# EAGLE schematic nrfice (EAGLE 9.5.1)

## Sheet 1 of 4
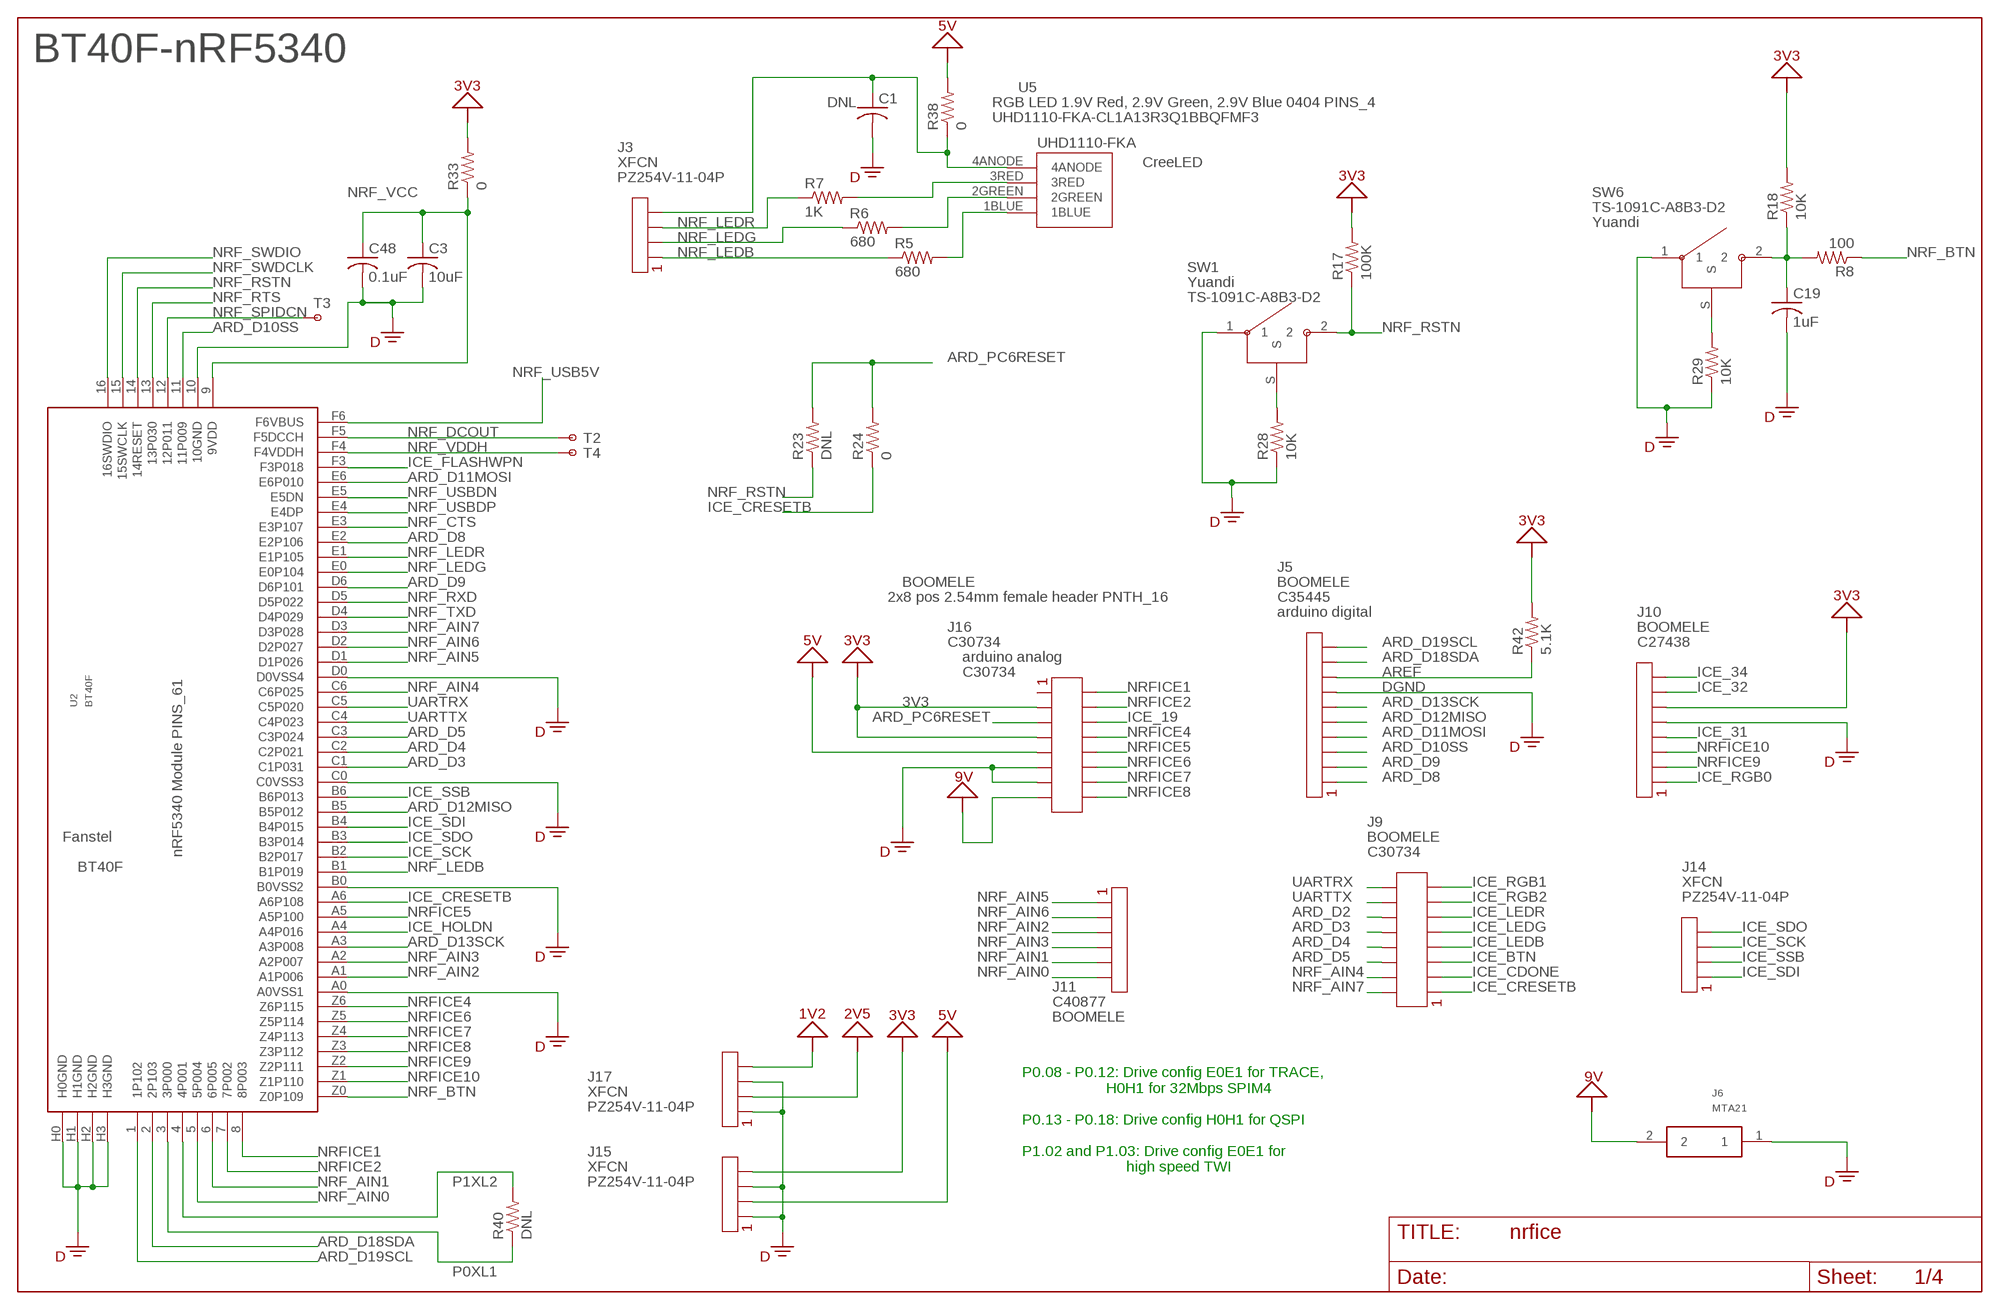
[diagram p0: schematic, sheet 1]
U$3 (FRAMES_LETTER): DESC: DNL

### Parts
C1  DNL  C-USC0402  [RCL_C0402]
C3  10uF  C-USC0805  [RCL_C0805]
C19  1uF  C-USC0402  [RCL_C0402]
C48  0.1uF  C-USC0402  [RCL_C0402]
J3  PZ254V-11-04P  [PZ254V-11-04P]
J5  C35445  [C35445]
J6  MTA21  [MTA21]
J9  C30734  [C30734]
J10  C27438  [C27438]
J11  C40877  [C40877]
J14  PZ254V-11-04P  [PZ254V-11-04P]
J15  PZ254V-11-04P  [PZ254V-11-04P]
J16  C30734  [C30734]
J17  PZ254V-11-04P  [PZ254V-11-04P]
R5  680  R-US_R0402  [RCL_R0402]
R6  680  R-US_R0402  [RCL_R0402]
R7  1K  R-US_R0402  [RCL_R0402]
R8  100  R-US_R0402  [RCL_R0402]
R17  100K  R-US_R0402  [RCL_R0402]
R18  10K  R-US_R0402  [RCL_R0402]
R23  DNL  R-US_R0402  [RCL_R0402]
R24  0  R-US_R0402  [RCL_R0402]
R28  10K  R-US_R0402  [RCL_R0402]
R29  10K  R-US_R0402  [RCL_R0402]
R33  0  R-US_R0603  [RCL_R0603]
R38  0  R-US_R0402  [RCL_R0402]
R40  DNL  R-US_R0402  [RCL_R0402]
R42  5.1K  R-US_R0402  [RCL_R0402]
SW1  TS-1091C-A8B3-D2  [TS-1091C-A8B3-D2]
SW6  TS-1091C-A8B3-D2  [TS-1091C-A8B3-D2]
T2  MTA1  [MTA1]
T3  MTA1  [MTA1]
T4  MTA1  [MTA1]
U2  BT40F  [BT40F]
U5  UHD1110-FKA  [UHD1110-FKA]

### Nets
1V2: J17.4 ; also sheet 2,3
2V5: J17.2 ; also sheet 2,3
3V3: J10.6 J15.4 J16.3 J16.7 R17.2 R18.2 R33.2 R42.2 ; also sheet 2,3,4
5V: J15.2 J16.9 R38.2 ; also sheet 2,3
9V: J6.2 J16.15 ; also sheet 2
ARD_D2: J9.12 ; also sheet 3
ARD_D3: J9.10 U2.C1(C1P031) ; also sheet 3
ARD_D4: J9.8 U2.C2(C2P021) ; also sheet 3
ARD_D5: J9.6 U2.C3(C3P024) ; also sheet 3
ARD_D8: J5.1 U2.E2(E2P106) ; also sheet 3
ARD_D9: J5.2 U2.D6(D6P101) ; also sheet 3
ARD_D10SS: J5.3 U2.11(11P009) ; also sheet 3
ARD_D11MOSI: J5.4 U2.E6(E6P010) ; also sheet 3
ARD_D12MISO: J5.5 U2.B5(B5P012) ; also sheet 3
ARD_D13SCK: J5.6 U2.A3(A3P008) ; also sheet 3
ARD_D18SDA: J5.9 U2.2(2P103) ; also sheet 3
ARD_D19SCL: J5.10 U2.1(1P102) ; also sheet 3
ARD_PC6RESET: J16.5 R23.2 R24.2
AREF: J5.8 R42.1
DGND: C1.2 C3.2 C19.2 C48.2 J5.7 J6.1 J10.5 J15.1 J15.3 J16.11 J16.13 J17.1 J17.3 R28.1 R29.1 SW1.1 SW6.1 U2.10(10GND) U2.A0(A0VSS1) U2.B0(B0VSS2) U2.C0(C0VSS3) U2.D0(D0VSS4) U2.H0(H0GND) U2.H1(H1GND) U2.H2(H2GND) U2.H3(H3GND) ; also sheet 2,3,4
ICE_19: J16.6 ; also sheet 3
ICE_31: J10.4 ; also sheet 3
ICE_32: J10.7 ; also sheet 3
ICE_34: J10.8 ; also sheet 3
ICE_BTN: J9.5 ; also sheet 3
ICE_CDONE: J9.3 ; also sheet 3
ICE_CRESETB: J9.1 R24.1 U2.A6(A6P108) ; also sheet 3
ICE_FLASHWPN: U2.F3(F3P018) ; also sheet 3
ICE_HOLDN: U2.A4(A4P016) ; also sheet 3
ICE_LEDB: J9.7 ; also sheet 3
ICE_LEDG: J9.9 ; also sheet 3
ICE_LEDR: J9.11 ; also sheet 3
ICE_RGB0: J10.1 ; also sheet 3
ICE_RGB1: J9.15 ; also sheet 3
ICE_RGB2: J9.13 ; also sheet 3
ICE_SCK: J14.3 U2.B2(B2P017) ; also sheet 3
ICE_SDI: J14.1 U2.B4(B4P015) ; also sheet 3
ICE_SDO: J14.4 U2.B3(B3P014) ; also sheet 3
ICE_SSB: J14.2 U2.B6(B6P013) ; also sheet 3
N$1: R5.2 U5.1BLUE
N$2: R6.2 U5.2GREEN
N$3: R7.2 U5.3RED
N$11: C19.1 R8.2 R18.1 SW6.2
N$13: R28.2 SW1.S
N$14: R29.2 SW6.S
N$15: C1.1 J3.4 R38.1 U5.4ANODE
NRF_AIN0: J11.6 U2.5(5P004)
NRF_AIN1: J11.5 U2.6(6P005)
NRF_AIN2: J11.3 U2.A1(A1P006)
NRF_AIN3: J11.4 U2.A2(A2P007)
NRF_AIN4: J9.4 U2.C6(C6P025)
NRF_AIN5: J11.1 U2.D1(D1P026)
NRF_AIN6: J11.2 U2.D2(D2P027)
NRF_AIN7: J9.2 U2.D3(D3P028)
NRF_BTN: R8.1 U2.Z0(Z0P109)
NRF_CTS: U2.E3(E3P107) ; also sheet 4
NRF_DCOUT: T2.1 U2.F5(F5DCCH)
NRF_LEDB: J3.1 R5.1 U2.B1(B1P019)
NRF_LEDG: J3.2 R6.1 U2.E0(E0P104)
NRF_LEDR: J3.3 R7.1 U2.E1(E1P105)
NRF_RSTN: R17.1 R23.1 SW1.2 U2.14(14RESET) ; also sheet 4
NRF_RTS: U2.13(13P030) ; also sheet 4
NRF_RXD: U2.D5(D5P022) ; also sheet 2,4
NRF_SPIDCN: T3.1 U2.12(12P011)
NRF_SWDCLK: U2.15(15SWCLK) ; also sheet 2,4
NRF_SWDIO: U2.16(16SWDIO) ; also sheet 2,4
NRF_TXD: U2.D4(D4P029) ; also sheet 2,4
NRF_USB5V: U2.F6(F6VBUS) ; also sheet 2
NRF_USBDN: U2.E5(E5DN) ; also sheet 2
NRF_USBDP: U2.E4(E4DP) ; also sheet 2
NRF_VCC: C3.1 C48.1 R33.1 U2.9(9VDD)
NRF_VDDH: T4.1 U2.F4(F4VDDH)
NRFICE1: J16.2 U2.8(8P003) ; also sheet 3
NRFICE2: J16.4 U2.7(7P002) ; also sheet 3
NRFICE4: J16.8 U2.Z6(Z6P115) ; also sheet 3
NRFICE5: J16.10 U2.A5(A5P100) ; also sheet 3
NRFICE6: J16.12 U2.Z5(Z5P114) ; also sheet 3
NRFICE7: J16.14 U2.Z4(Z4P113) ; also sheet 3
NRFICE8: J16.16 U2.Z3(Z3P112) ; also sheet 3
NRFICE9: J10.2 U2.Z2(Z2P111) ; also sheet 3
NRFICE10: J10.3 U2.Z1(Z1P110) ; also sheet 3
P0XL1: R40.1 U2.3(3P000)
P1XL2: R40.2 U2.4(4P001)
UARTRX: J9.16 U2.C5(C5P020) ; also sheet 3
UARTTX: J9.14 U2.C4(C4P023) ; also sheet 3
Unconnected: J16.1

### Notes on the sheet
- BT40F-nRF5340
- arduino digital
- arduino analog
- P0.08 - P0.12: Drive config E0E1 for TRACE, 
                       H0H1 for 32Mbps SPIM4
  
  P0.13 - P0.18: Drive config H0H1 for QSPI
  
  P1.02 and P1.03: Drive config E0E1 for 
                            high speed TWI

## Sheet 2 of 4
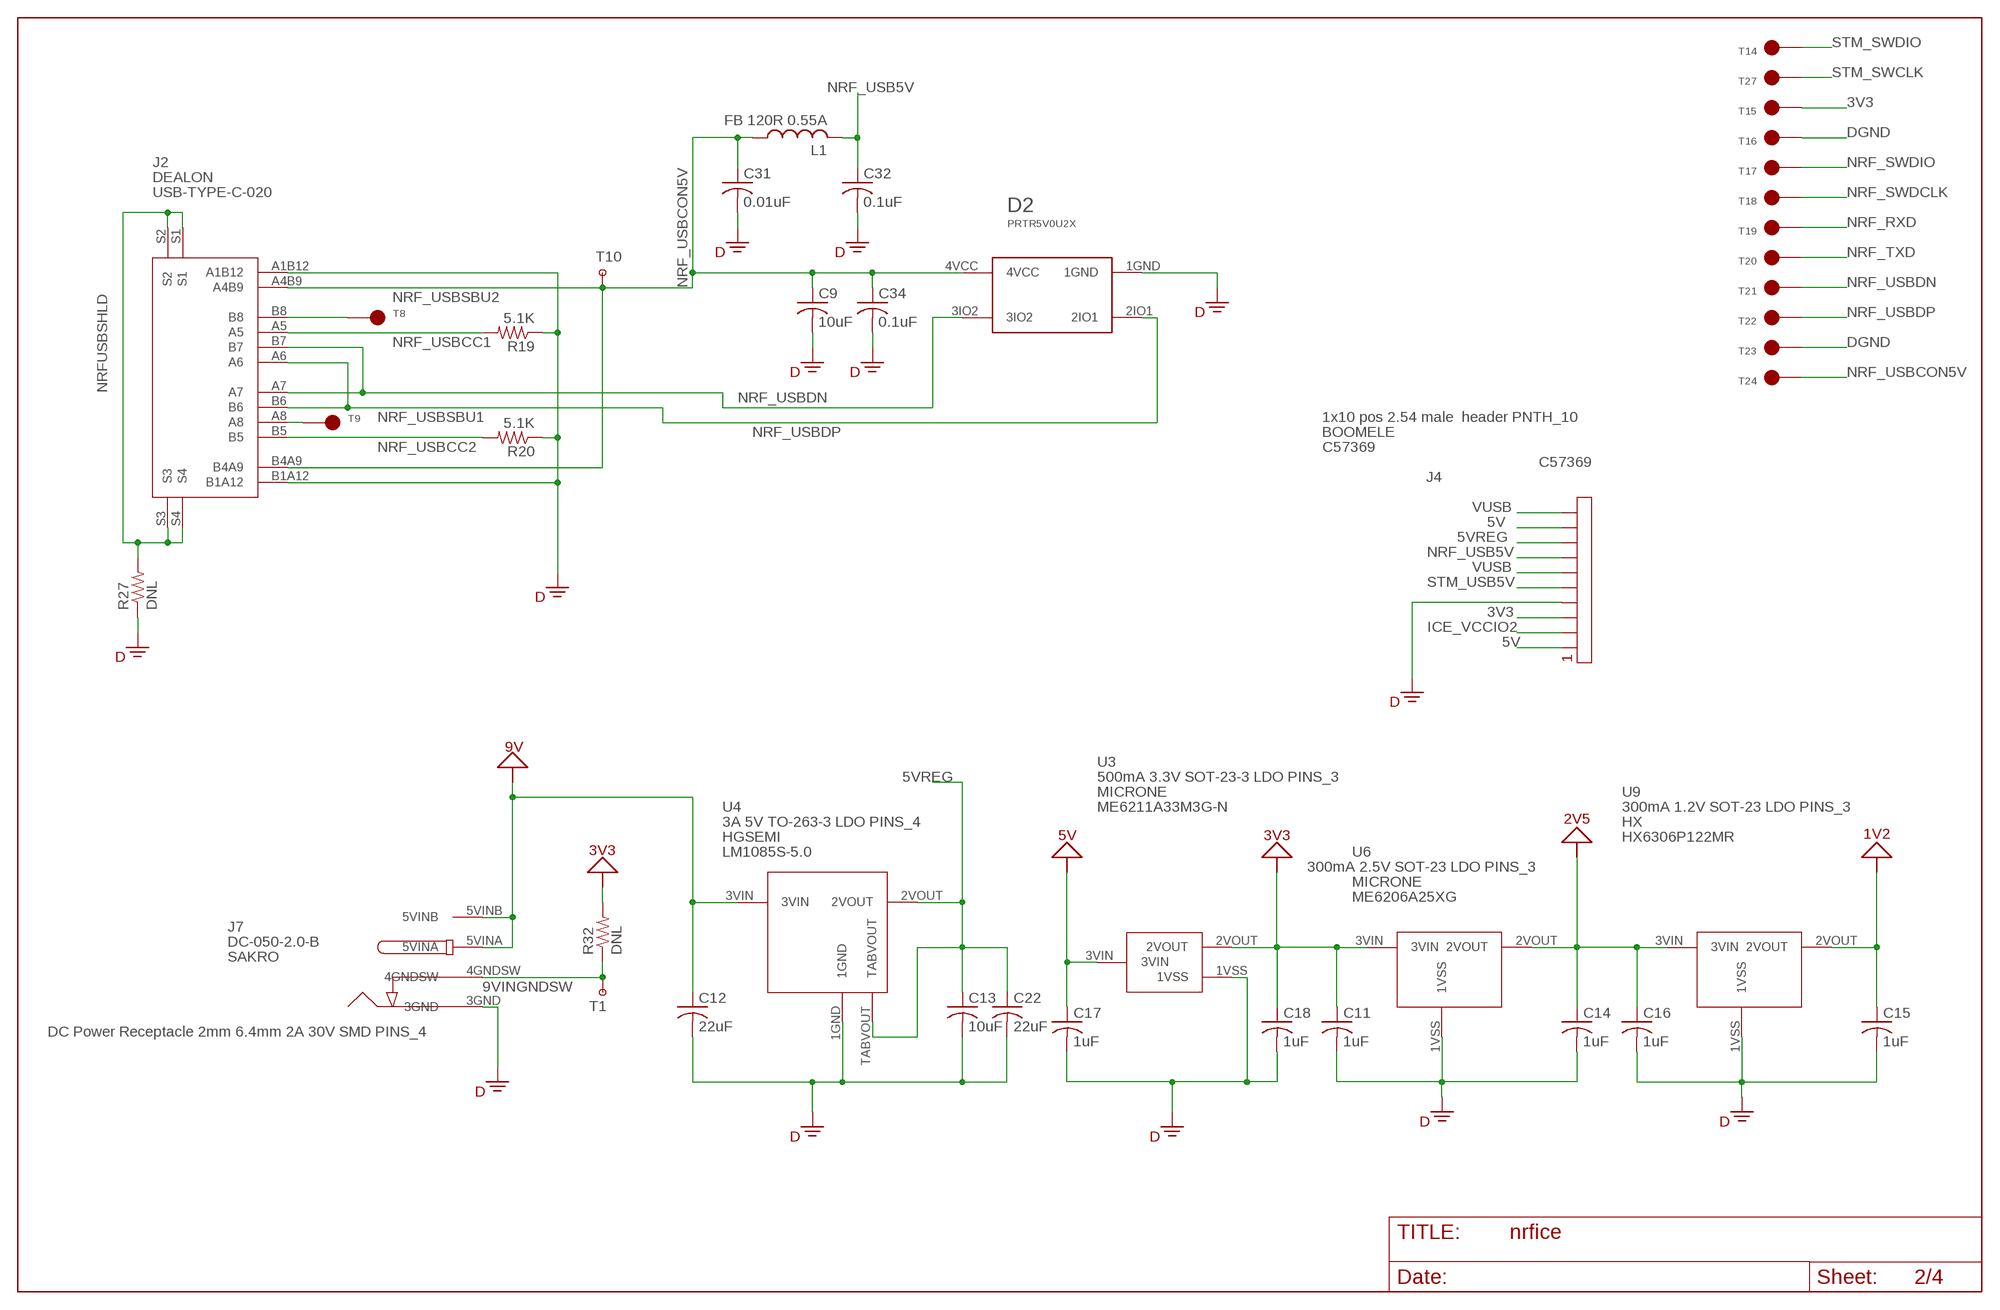
[diagram p1: schematic, sheet 2]
U$33 (FRAMES_LETTER): DESC: DNL

### Parts
C9  10uF  C-USC0805  [RCL_C0805]
C11  1uF  C-USC0402  [RCL_C0402]
C12  22uF  C-USC0805  [RCL_C0805]
C13  10uF  C-USC0805  [RCL_C0805]
C14  1uF  C-USC0402  [RCL_C0402]
C15  1uF  C-USC0402  [RCL_C0402]
C16  1uF  C-USC0402  [RCL_C0402]
C17  1uF  C-USC0402  [RCL_C0402]
C18  1uF  C-USC0402  [RCL_C0402]
C22  22uF  C-USC0805  [RCL_C0805]
C31  0.01uF  C-USC0402  [RCL_C0402]
C32  0.1uF  C-USC0402  [RCL_C0402]
C34  0.1uF  C-USC0402  [RCL_C0402]
D2  PRTR5V0U2X  [PRTR5V0U2X]
J2  USB-TYPE-C-020  [USB-TYPE-C-020]
J4  C57369  [C57369]
J7  DC-050-2.0-B  [DC-050-2.0-B]
L1  FB 120R 0.55A  L-USL0402  [L0402]
R19  5.1K  R-US_R0402  [RCL_R0402]
R20  5.1K  R-US_R0402  [RCL_R0402]
R27  DNL  R-US_R0402  [RCL_R0402]
R32  DNL  R-US_R0402  [RCL_R0402]
T1  MTA1  [MTA1]
T8  T  [T]
T9  T  [T]
T10  MTA1  [MTA1]
T14  TT2  [T2]
T15  TT2  [T2]
T16  TT2  [T2]
T17  TT2  [T2]
T18  TT2  [T2]
T19  TT2  [T2]
T20  TT2  [T2]
T21  TT2  [T2]
T22  TT2  [T2]
T23  TT2  [T2]
T24  TT2  [T2]
T27  TT2  [T2]
U3  ME6211A33M3G-N  [ME6211A33M3G-N]
U4  LM1085S-5.0  [LM1085S-5.0]
U6  ME6206A25XG  [ME6206A25XG]
U9  HX6306P122MR  [HX6306P122MR]

### Nets
1V2: C15.1 U9.2VOUT ; also sheet 1,3
2V5: C14.1 C16.1 U6.2VOUT U9.3VIN ; also sheet 1,3
3V3: C11.1 C18.1 J4.3 R32.2 T15.T U3.2VOUT U6.3VIN ; also sheet 1,3,4
5V: C17.1 J4.1 J4.9 U3.3VIN ; also sheet 1,3
5VREG: C13.1 C22.1 J4.8 U4.2VOUT U4.TABVOUT
9V: C12.1 J7.5VINA J7.5VINB U4.3VIN ; also sheet 1
9VINGNDSW: J7.4GNDSW R32.1 T1.1
DGND: C9.2 C11.2 C12.2 C13.2 C14.2 C15.2 C16.2 C17.2 C18.2 C22.2 C31.2 C32.2 C34.2 D2.1GND J2.A1B12 J2.B1A12 J4.4 J7.3GND R19.1 R20.1 R27.1 T16.T T23.T U3.1VSS U4.1GND U6.1VSS U9.1VSS ; also sheet 1,3,4
ICE_VCCIO2: J4.2 ; also sheet 3
NRF_RXD: T19.T ; also sheet 1,4
NRF_SWDCLK: T18.T ; also sheet 1,4
NRF_SWDIO: T17.T ; also sheet 1,4
NRF_TXD: T20.T ; also sheet 1,4
NRF_USB5V: C32.1 J4.7 L1.2 ; also sheet 1
NRF_USBCC1: J2.A5 R19.2
NRF_USBCC2: J2.B5 R20.2
NRF_USBCON5V: C9.1 C31.1 C34.1 D2.4VCC J2.A4B9 J2.B4A9 L1.1 T10.1 T24.T
NRF_USBDN: D2.3IO2 J2.A7 J2.B7 T21.T ; also sheet 1
NRF_USBDP: D2.2IO1 J2.A6 J2.B6 T22.T ; also sheet 1
NRF_USBSBU1: J2.A8 T9.T
NRF_USBSBU2: J2.B8 T8.T
NRFUSBSHLD: J2.S1 J2.S2 J2.S3 J2.S4 R27.2
STM_SWCLK: T27.T ; also sheet 4
STM_SWDIO: T14.T ; also sheet 4
STM_USB5V: J4.5 ; also sheet 4
VUSB: J4.6 J4.10

## Sheet 3 of 4
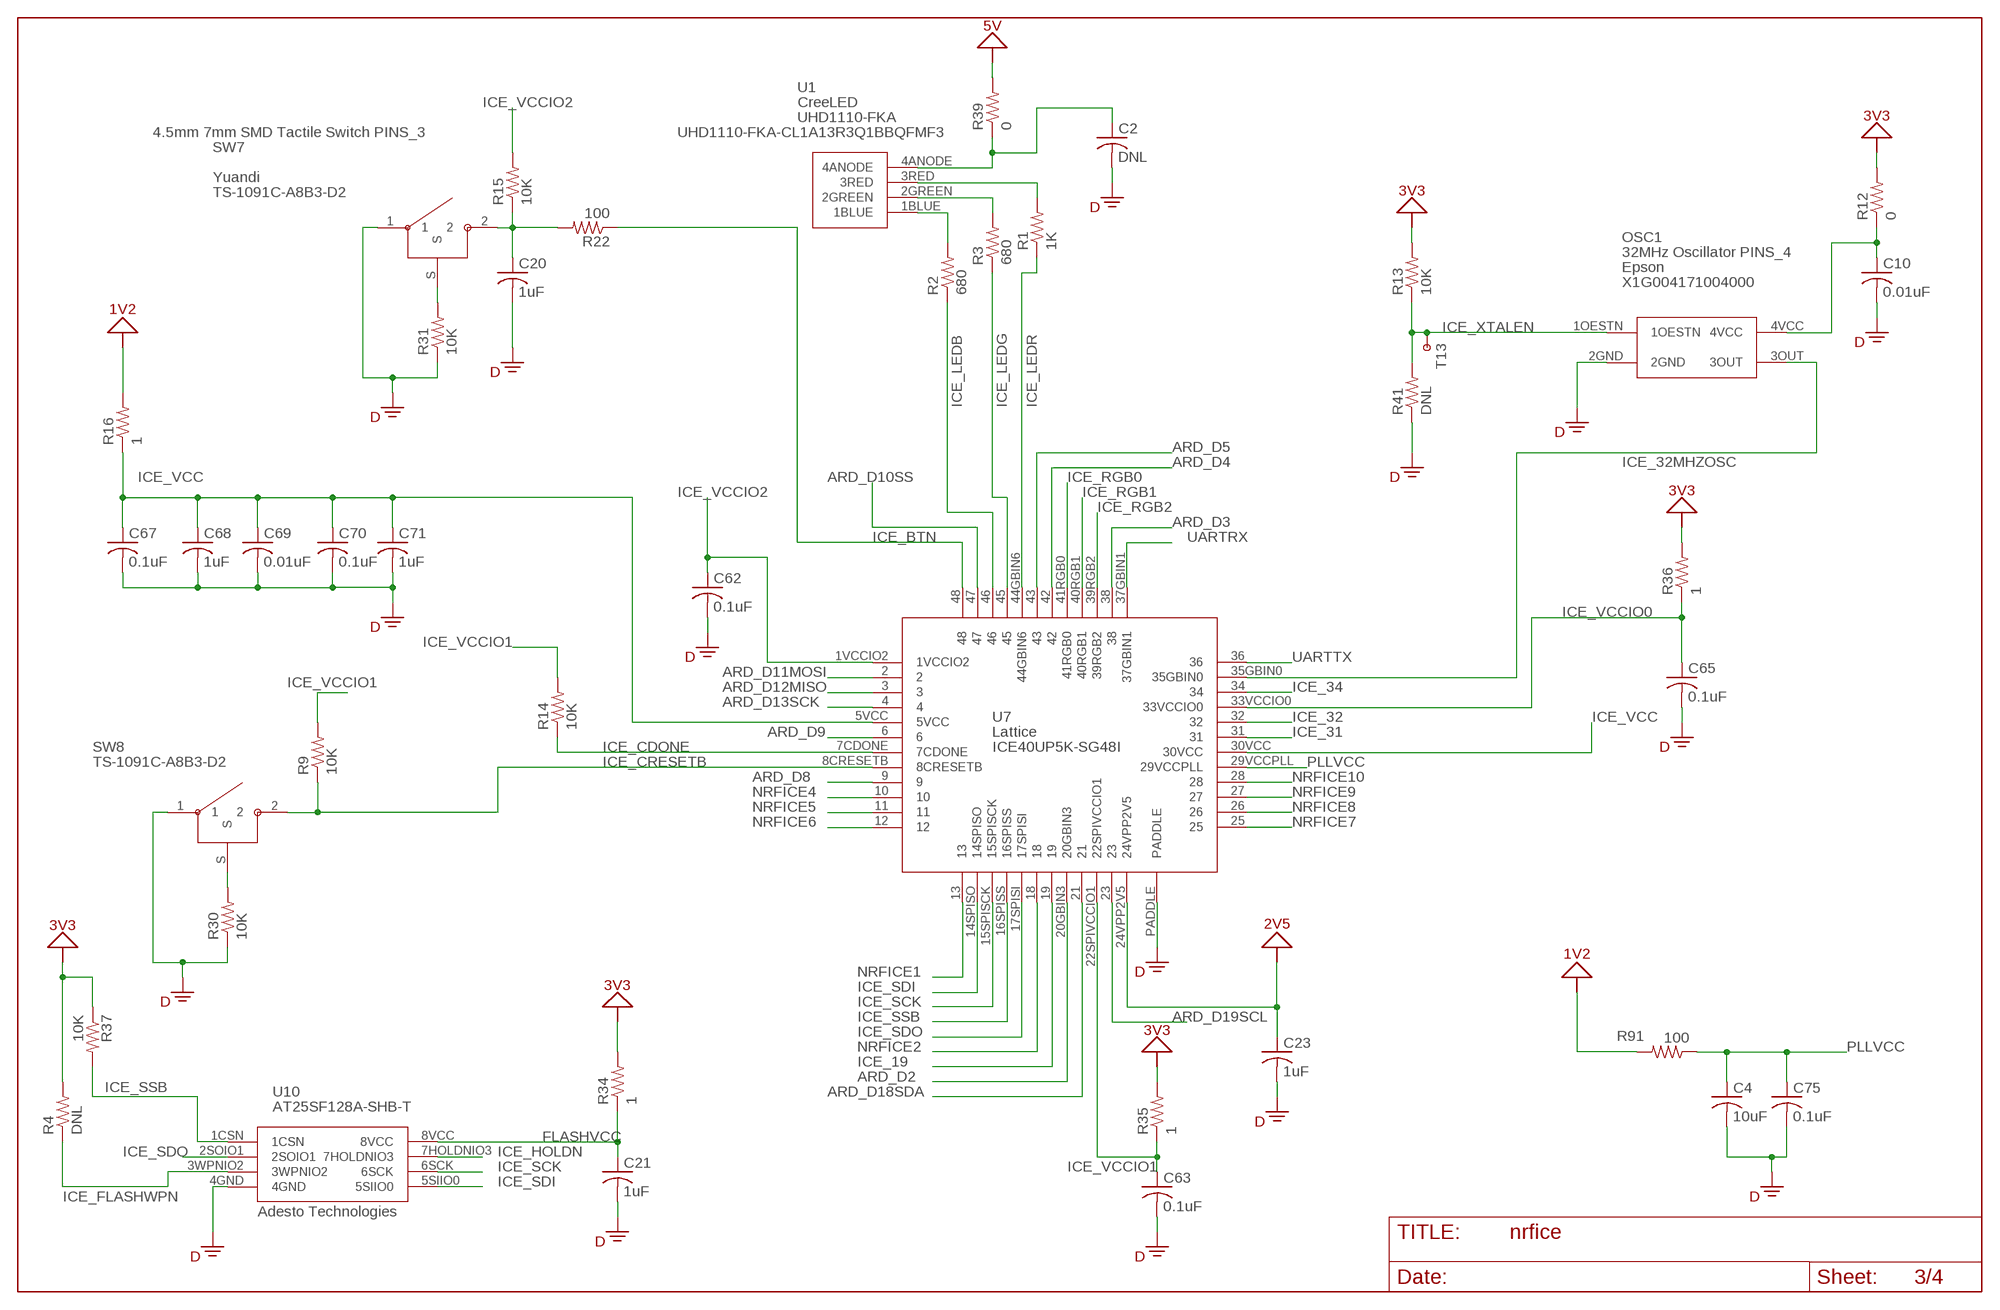
[diagram p2: schematic, sheet 3]
U$128 (FRAMES_LETTER): DESC: DNL

### Parts
C2  DNL  C-USC0402  [RCL_C0402]
C4  10uF  C-USC0805  [RCL_C0805]
C10  0.01uF  C-USC0402  [RCL_C0402]
C20  1uF  C-USC0402  [RCL_C0402]
C21  1uF  C-USC0402  [RCL_C0402]
C23  1uF  C-USC0402  [RCL_C0402]
C62  0.1uF  C-USC0402  [RCL_C0402]
C63  0.1uF  C-USC0402  [RCL_C0402]
C65  0.1uF  C-USC0402  [RCL_C0402]
C67  0.1uF  C-USC0402  [RCL_C0402]
C68  1uF  C-USC0402  [RCL_C0402]
C69  0.01uF  C-USC0402  [RCL_C0402]
C70  0.1uF  C-USC0402  [RCL_C0402]
C71  1uF  C-USC0402  [RCL_C0402]
C75  0.1uF  C-USC0402  [RCL_C0402]
OSC1  X1G004171004000  [X1G004171004000]
R1  1K  R-US_R0402  [RCL_R0402]
R2  680  R-US_R0402  [RCL_R0402]
R3  680  R-US_R0402  [RCL_R0402]
R4  DNL  R-US_R0402  [RCL_R0402]
R9  10K  R-US_R0402  [RCL_R0402]
R12  0  R-US_R0603  [RCL_R0603]
R13  10K  R-US_R0402  [RCL_R0402]
R14  10K  R-US_R0402  [RCL_R0402]
R15  10K  R-US_R0402  [RCL_R0402]
R16  1  R-US_R0603  [RCL_R0603]
R22  100  R-US_R0402  [RCL_R0402]
R30  10K  R-US_R0402  [RCL_R0402]
R31  10K  R-US_R0402  [RCL_R0402]
R34  1  R-US_R0603  [RCL_R0603]
R35  1  R-US_R0603  [RCL_R0603]
R36  1  R-US_R0603  [RCL_R0603]
R37  10K  R-US_R0402  [RCL_R0402]
R39  0  R-US_R0402  [RCL_R0402]
R41  DNL  R-US_R0402  [RCL_R0402]
R91  100  R-US_R0402  [RCL_R0402]
SW7  TS-1091C-A8B3-D2  [TS-1091C-A8B3-D2]
SW8  TS-1091C-A8B3-D2  [TS-1091C-A8B3-D2]
T13  MTA1  [MTA1]
U1  UHD1110-FKA  [UHD1110-FKA]
U7  ICE40UP5K-SG48I  [ICE40UP5K-SG48I]
U10  AT25SF128A-SHB-T  [AT25SF128A-SHB-T]

### Nets
1V2: R16.2 R91.2 ; also sheet 1,2
2V5: C23.1 U7.24VPP2V5 ; also sheet 1,2
3V3: R4.2 R12.2 R13.2 R34.2 R35.2 R36.2 R37.1 ; also sheet 1,2,4
5V: R39.2 ; also sheet 1,2
ARD_D2: U7.20GBIN3 ; also sheet 1
ARD_D3: U7.38 ; also sheet 1
ARD_D4: U7.42 ; also sheet 1
ARD_D5: U7.43 ; also sheet 1
ARD_D8: U7.9 ; also sheet 1
ARD_D9: U7.6 ; also sheet 1
ARD_D10SS: U7.47 ; also sheet 1
ARD_D11MOSI: U7.2 ; also sheet 1
ARD_D12MISO: U7.3 ; also sheet 1
ARD_D13SCK: U7.4 ; also sheet 1
ARD_D18SDA: U7.21 ; also sheet 1
ARD_D19SCL: U7.23 ; also sheet 1
DGND: C2.2 C4.2 C10.2 C20.2 C21.2 C23.2 C62.2 C63.2 C65.2 C67.2 C68.2 C69.2 C70.2 C71.2 C75.2 OSC1.2GND R30.1 R31.1 R41.1 SW7.1 SW8.1 U7.PADDLE U10.4GND ; also sheet 1,2,4
FLASHVCC: C21.1 R34.1 U10.8VCC
ICE_19: U7.19 ; also sheet 1
ICE_31: U7.31 ; also sheet 1
ICE_32: U7.32 ; also sheet 1
ICE_32MHZOSC: OSC1.3OUT U7.35GBIN0
ICE_34: U7.34 ; also sheet 1
ICE_BTN: R22.1 U7.48 ; also sheet 1
ICE_CDONE: R14.1 U7.7CDONE ; also sheet 1
ICE_CRESETB: R9.1 SW8.2 U7.8CRESETB ; also sheet 1
ICE_FLASHWPN: R4.1 U10.3WPNIO2 ; also sheet 1
ICE_HOLDN: U10.7HOLDNIO3 ; also sheet 1
ICE_LEDB: R2.1 U7.46 ; also sheet 1
ICE_LEDG: R3.1 U7.45 ; also sheet 1
ICE_LEDR: R1.1 U7.44GBIN6 ; also sheet 1
ICE_RGB0: U7.41RGB0 ; also sheet 1
ICE_RGB1: U7.40RGB1 ; also sheet 1
ICE_RGB2: U7.39RGB2 ; also sheet 1
ICE_SCK: U7.15SPISCK U10.6SCK ; also sheet 1
ICE_SDI: U7.14SPISO U10.5SIIO0 ; also sheet 1
ICE_SDO: U7.17SPISI U10.2SOIO1 ; also sheet 1
ICE_SSB: R37.2 U7.16SPISS U10.1CSN ; also sheet 1
ICE_VCC: C67.1 C68.1 C69.1 C70.1 C71.1 R16.1 U7.5VCC U7.30VCC
ICE_VCCIO0: C65.1 R36.1 U7.33VCCIO0
ICE_VCCIO1: C63.1 R9.2 R14.2 R35.1 U7.22SPIVCCIO1
ICE_VCCIO2: C62.1 R15.2 U7.1VCCIO2 ; also sheet 2
ICE_XTALEN: OSC1.1OESTN R13.1 R41.2 T13.1
N$4: R1.2 U1.3RED
N$5: R3.2 U1.2GREEN
N$6: R2.2 U1.1BLUE
N$8: C10.1 OSC1.4VCC R12.1
N$9: C20.1 R15.1 R22.2 SW7.2
N$12: R31.2 SW7.S
N$16: R30.2 SW8.S
N$17: C2.1 R39.1 U1.4ANODE
NRFICE1: U7.13 ; also sheet 1
NRFICE2: U7.18 ; also sheet 1
NRFICE4: U7.10 ; also sheet 1
NRFICE5: U7.11 ; also sheet 1
NRFICE6: U7.12 ; also sheet 1
NRFICE7: U7.25 ; also sheet 1
NRFICE8: U7.26 ; also sheet 1
NRFICE9: U7.27 ; also sheet 1
NRFICE10: U7.28 ; also sheet 1
PLLVCC: C4.1 C75.1 R91.1 U7.29VCCPLL
UARTRX: U7.37GBIN1 ; also sheet 1
UARTTX: U7.36 ; also sheet 1

## Sheet 4 of 4
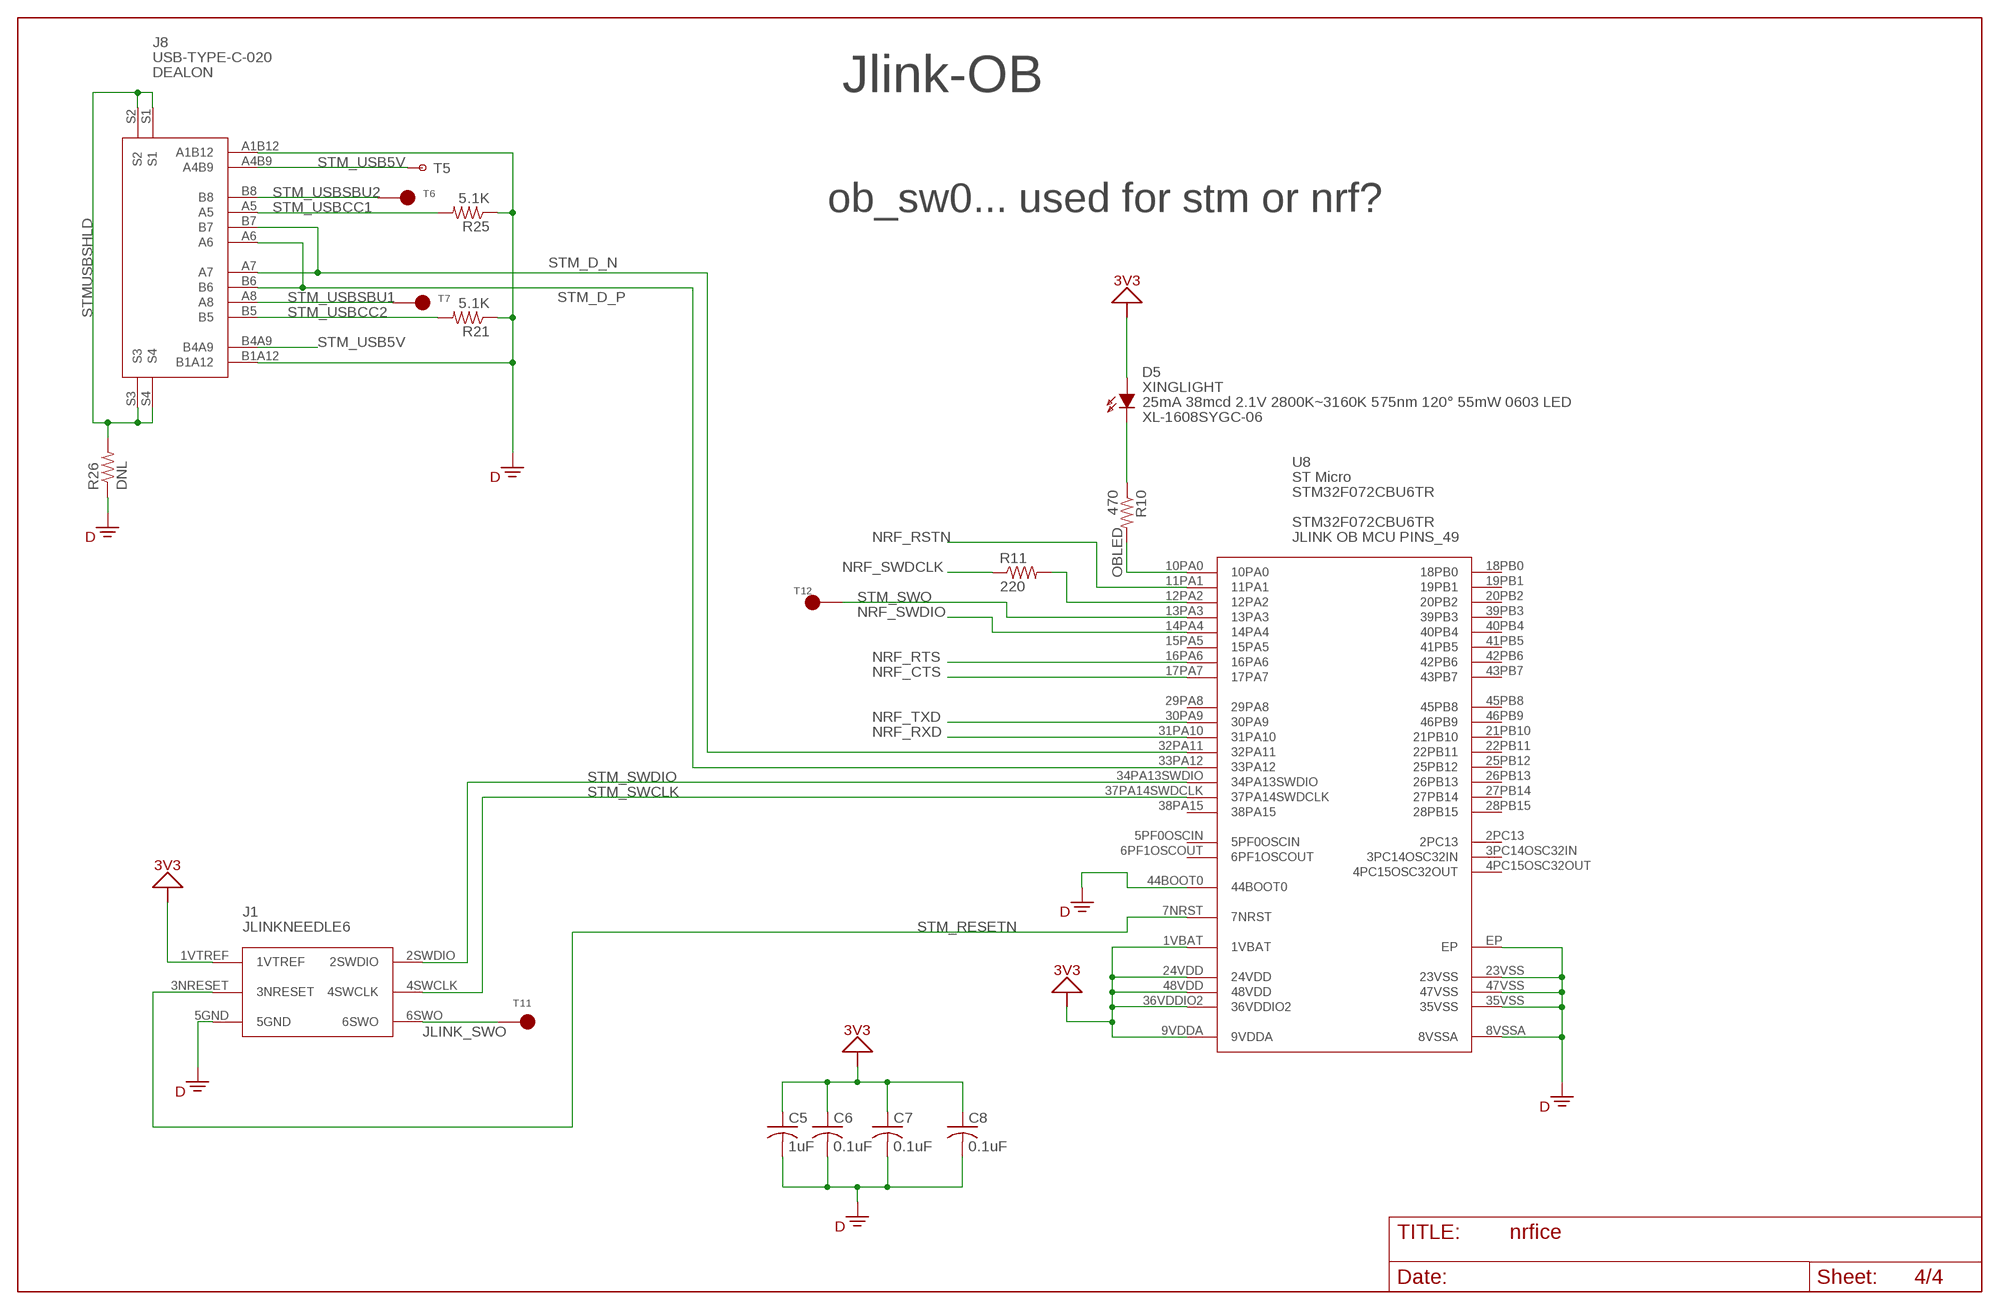
[diagram p3: schematic, sheet 4]
U$15 (FRAMES_LETTER): DESC: DNL

### Parts
C5  1uF  C-USC0402  [RCL_C0402]
C6  0.1uF  C-USC0402  [RCL_C0402]
C7  0.1uF  C-USC0402  [RCL_C0402]
C8  0.1uF  C-USC0402  [RCL_C0402]
D5  XL-1608SYGC-06  [XL-1608SYGC-06]
J1  JLINKNEEDLE6  [JLINKNEEDLE6]
J8  USB-TYPE-C-020  [USB-TYPE-C-020]
R10  470  R-US_R0402  [RCL_R0402]
R11  220  R-US_R0402  [RCL_R0402]
R21  5.1K  R-US_R0402  [RCL_R0402]
R25  5.1K  R-US_R0402  [RCL_R0402]
R26  DNL  R-US_R0402  [RCL_R0402]
T5  MTA1  [MTA1]
T6  T  [T]
T7  T  [T]
T11  T  [T]
T12  T  [T]
U8  STM32F072CBU6TR  [STM32F072CBU6TR]

### Nets
3V3: C5.1 C6.1 C7.1 C8.1 D5.A J1.1VTREF U8.1VBAT U8.9VDDA U8.24VDD U8.36VDDIO2 U8.48VDD ; also sheet 1,2,3
DGND: C5.2 C6.2 C7.2 C8.2 J1.5GND J8.A1B12 J8.B1A12 R21.1 R25.1 R26.1 U8.8VSSA U8.23VSS U8.35VSS U8.44BOOT0 U8.47VSS U8.EP ; also sheet 1,2,3
JLINK_SWO: J1.6SWO T11.T
N$7: R11.2 U8.12PA2
N$10: D5.C R10.1
NRF_CTS: U8.17PA7 ; also sheet 1
NRF_RSTN: U8.11PA1 ; also sheet 1
NRF_RTS: U8.16PA6 ; also sheet 1
NRF_RXD: U8.31PA10 ; also sheet 1,2
NRF_SWDCLK: R11.1 ; also sheet 1,2
NRF_SWDIO: U8.14PA4 ; also sheet 1,2
NRF_TXD: U8.30PA9 ; also sheet 1,2
OBLED: R10.2 U8.10PA0
STM_D_N: J8.A7 J8.B7 U8.32PA11
STM_D_P: J8.A6 J8.B6 U8.33PA12
STM_RESETN: J1.3NRESET U8.7NRST
STM_SWCLK: J1.4SWCLK U8.37PA14SWDCLK ; also sheet 2
STM_SWDIO: J1.2SWDIO U8.34PA13SWDIO ; also sheet 2
STM_SWO: T12.T U8.13PA3
STM_USB5V: J8.A4B9 J8.B4A9 T5.1 ; also sheet 2
STM_USBCC1: J8.A5 R25.2
STM_USBCC2: J8.B5 R21.2
STM_USBSBU1: J8.A8 T7.T
STM_USBSBU2: J8.B8 T6.T
STMUSBSHLD: J8.S1 J8.S2 J8.S3 J8.S4 R26.2
Unconnected: U8.2PC13 U8.3PC14OSC32IN U8.4PC15OSC32OUT U8.5PF0OSCIN U8.6PF1OSCOUT U8.15PA5 U8.18PB0 U8.19PB1 U8.20PB2 U8.21PB10 U8.22PB11 U8.25PB12 U8.26PB13 U8.27PB14 U8.28PB15 U8.29PA8 U8.38PA15 U8.39PB3 U8.40PB4 U8.41PB5 U8.42PB6 U8.43PB7 U8.45PB8 U8.46PB9

### Notes on the sheet
- Jlink-OB
- ob_sw0... used for stm or nrf?

## Library data of the parts
C1 C2 = nrfice04:C-US: CAPACITOR, American symbol; DESC: DNL; MAN: Samsung; MPN: CL05A105KP5NNNC
C3 C4 C9 C13 = nrfice04:C-US: CAPACITOR, American symbol; DESC: 10uF,16V,10%,X5R,0805; MAN: Samsung; MPN: CL21A106KOQNNNE
C5 C11 C14-C21 C23 C68 C71 = nrfice04:C-US: CAPACITOR, American symbol; DESC: 1uF,10V,10%,X5R,0402; MAN: Samsung; MPN: CL05A105KP5NNNC
C6-C8 C32 C34 C48 C62 C63 C65 C67 C70 C75 = nrfice04:C-US: CAPACITOR, American symbol; DESC: 0.1uF,10V,10%,X7R,0402; MAN: KEMET; MPN: C0402C104K8RAC7867
C10 C31 C69 = nrfice04:C-US: CAPACITOR, American symbol; DESC: 0.01uF,16V,5%,X7R,0402; MAN: KEMET; MPN: C0402C103J4RAC
C12 C22 = nrfice04:C-US: CAPACITOR, American symbol; DESC: 22uF,25V,20%,X5R,0805; MAN: Samsung; MPN: CL21A226MAYNNNE
D2 = nrfice04:PRTR5V0U2X; DESC: TVS DIODE 5.5VWM SOT143B PINS_4; MAN: Nexperia; MPN: PRTR5V0U2X
D5 = nrfice04:XL-1608SYGC-06; DESC: 25mA 38mcd 2.1V 2800K~3160K 575nm 120° 55mW 0603 LED; MAN: XINGLIGHT; MPN: XL-1608SYGC-06
J1 = nrfice04:JLINKNEEDLE6; DESC: DNL
J2 J8 = nrfice04:USB-TYPE-C-020; DESC: usb type c connector PINS_12; MAN: DEALON; MPN: USB-TYPE-C-020
J3 J14 J15 J17 = nrfice04:PZ254V-11-04P; DESC: 1x4 pos 2.54 male header PNTH_4; MAN: XFCN; MPN: PZ254V-11-04P
J4 = nrfice04:C57369; DESC: 1x10 pos 2.54 male header PNTH_10; MAN: BOOMELE; MPN: C57369
J5 = nrfice04:C35445; DESC: 1x10 pos 2.54 female header PNTH_10; MAN: BOOMELE; MPN: C35445
J6 = nrfice04:MTA21
J7 = nrfice04:DC-050-2.0-B; DESC: DC Power Receptacle 2mm 6.4mm 2A 30V SMD PINS_4; MAN: SAKRO; MPN: DC-050-2.0-B
J9 J16 = nrfice04:C30734; DESC: 2x8 pos 2.54mm female header PNTH_16; MAN: BOOMELE; MPN: C30734
J10 = nrfice04:C27438; DESC: DNL; MAN: BOOMELE; MPN: C27438
J11 = nrfice04:C40877; DESC: 1x6 pos 2.54 female header PNTH_6; MAN: BOOMELE; MPN: C40877
L1 = nrfice04:L-US: INDUCTOR, American symbol; DESC: FERRITE BEAD 120 OHM 0402 1LN; MAN: Murata; MPN: BLM15AG121SN1D
OSC1 = nrfice04:X1G004171004000; DESC: 32MHz Oscillator PINS_4; MAN: Epson; MPN: X1G004171004000
R1 R7 = nrfice04:R-US_: RESISTOR, American symbol; DESC: 1K Ohm,1%,1/16W,0402; MAN: YAGEO; MPN: RC0402FR-071KL
R2 R3 R5 R6 = nrfice04:R-US_: RESISTOR, American symbol; DESC: 680 Ohms,1%,1/16W,0402; MAN: YAGEO; MPN: RC0402FR-07680RL
R4 R23 R26 R27 R32 R40 R41 = nrfice04:R-US_: RESISTOR, American symbol; DESC: DNL; MAN: YAGEO; MPN: RC0402FR-0710KL
R8 R22 R91 = nrfice04:R-US_: RESISTOR, American symbol; DESC: 100 Ohm,1%,1/16W,0402; MAN: YAGEO; MPN: RC0402FR-07100RL
R9 R13-R15 R18 R28-R31 R37 = nrfice04:R-US_: RESISTOR, American symbol; DESC: 10K Ohm,1%,1/16W,0402; MAN: YAGEO; MPN: RC0402FR-0710KL
R10 = nrfice04:R-US_: RESISTOR, American symbol; DESC: 470 Ohm,1%,1/16W,0402; MAN: YAGEO; MPN: RC0402FR-07470RL
R11 = nrfice04:R-US_: RESISTOR, American symbol; DESC: 220 Ohm,1%,1/16W,0402; MAN: YAGEO; MPN: RC0402FR-07220RL
R12 R33 = nrfice04:R-US_: RESISTOR, American symbol; DESC: 0 Ohm,1%,1/10W,0603; MAN: YAGEO; MPN: RC0603FR-070RL
R16 R34-R36 = nrfice04:R-US_: RESISTOR, American symbol; DESC: 1 Ohm,1%,1/10W,0603; MAN: YAGEO; MPN: RC0603FR-071RL
R17 = nrfice04:R-US_: RESISTOR, American symbol; DESC: 100K Ohm,1%,1/16W,0402; MAN: YAGEO; MPN: RC0402FR-07100KL
R19-R21 R25 R42 = nrfice04:R-US_: RESISTOR, American symbol; DESC: 5.1K Ohm,1%,1/16W,0402; MAN: YAGEO; MPN: RC0402FR-075K1L
R24 R38 R39 = nrfice04:R-US_: RESISTOR, American symbol; DESC: 0 Ohm,1%,1/16W,0402; MAN: YAGEO; MPN: RC0402FR-070RL
SW1 SW6-SW8 = nrfice04:TS-1091C-A8B3-D2; DESC: 4.5mm 7mm SMD Tactile Switch PINS_3; MAN: Yuandi; MPN: TS-1091C-A8B3-D2
T1-T5 T10 T13 = nrfice04:MTA1; DESC: DNL
T6-T9 T11 T12 = nrfice04:T; DESC: DNL
T14-T24 T27 = nrfice04:T
U1 U5 = nrfice04:UHD1110-FKA; DESC: RGB LED 1.9V Red, 2.9V Green, 2.9V Blue 0404 PINS_4; MAN: CreeLED; MPN: UHD1110-FKA-CL1A13R3Q1BBQFMF3
U2 = nrfice04:BT40F; DESC: nRF5340 Module PINS_61; MAN: Fanstel; MPN: BT40F
U3 = nrfice04:ME6211A33M3G-N; DESC: 500mA 3.3V SOT-23-3 LDO PINS_3; MAN: MICRONE; MPN: ME6211A33M3G-N
U4 = nrfice04:LM1085S-5.0; DESC: 3A 5V TO-263-3 LDO PINS_4; MAN: HGSEMI; MPN: LM1085S-5.0
U6 = nrfice04:ME6206A25XG; DESC: 300mA 2.5V SOT-23 LDO PINS_3; MAN: MICRONE; MPN: ME6206A25XG
U7 = nrfice04:ICE40UP5K-SG48I; DESC: FPGA 48-VFQFN PINS_48; MAN: Lattice; MPN: ICE40UP5K-SG48I
U8 = nrfice04:STM32F072CBU6TR; DESC: JLINK OB MCU PINS_49; MAN: ST Micro; MPN: STM32F072CBU6TR
U9 = nrfice04:HX6306P122MR; DESC: 300mA 1.2V SOT-23 LDO PINS_3; MAN: HX; MPN: HX6306P122MR
U10 = nrfice04:AT25SF128A-SHB-T; DESC: NOR Flash 128 Mbit,2.7V to 3.6V,SOIC-W 208mil PINS_8; MAN: Adesto Technologies; MPN: AT25SF128A-SHB-T